# Altium schematic sheet LM2596.SchDoc
size A4
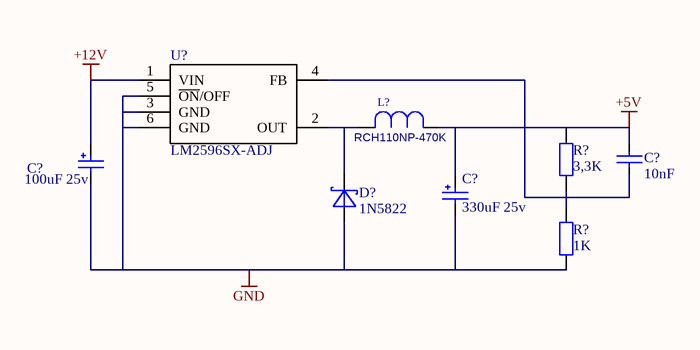
[diagram p0: LM2596.SchDoc]

## Parts
(Parts that share a designator on the sheet are numbered #1, #2 ... from top to bottom, then left to right.)
C?#1  10nF  [C_0805]
C?#2  value 100uF 25v  [8x11]  (hidden comment: Cap_Polar)
C?#3  value 330uF 25v  [10x16]  (hidden comment: Cap_Polar)
D?  1N5822  [DO-201_Vertical]
L?  RCH110NP-470K  [RCH-110]
R?#1  value 3,3K  [R_1206]  (hidden comment: Resistor 1206)
R?#2  value 1K  [R_1206]  (hidden comment: Resistor 1206)
U?  LM2596SX-ADJ  [D2PAK_5p]

## Nets
+5V: C?#1.1 C?#3.1 L?.1 R?#1.1
+12V: C?#2.1 U?.1(VIN)
GND: C?#2.2 C?#3.2 D?.1(A) R?#2.2 U?.3(GND) U?.5(~{ON}/OFF) U?.6(GND)
NetC?#1_2: C?#1.2 R?#1.2 R?#2.1 U?.4(FB)
NetD?_2: D?.2(C) L?.2 U?.2(OUT)

## Library data of the parts
C?#1 = Cap_Semi: Capacitor semi
C?#2 C?#3 = Cap_Polar: Capacitor Polar
D? = 1N5822: Diode Schottky
L? = Inductor: Value: RCH110NP-470K
U? = LM2596SX-ADJ: Easy Switcher 3.0A Step-Down Voltage Regulator